# Altium schematic sheet pwr.SchDoc
size A4
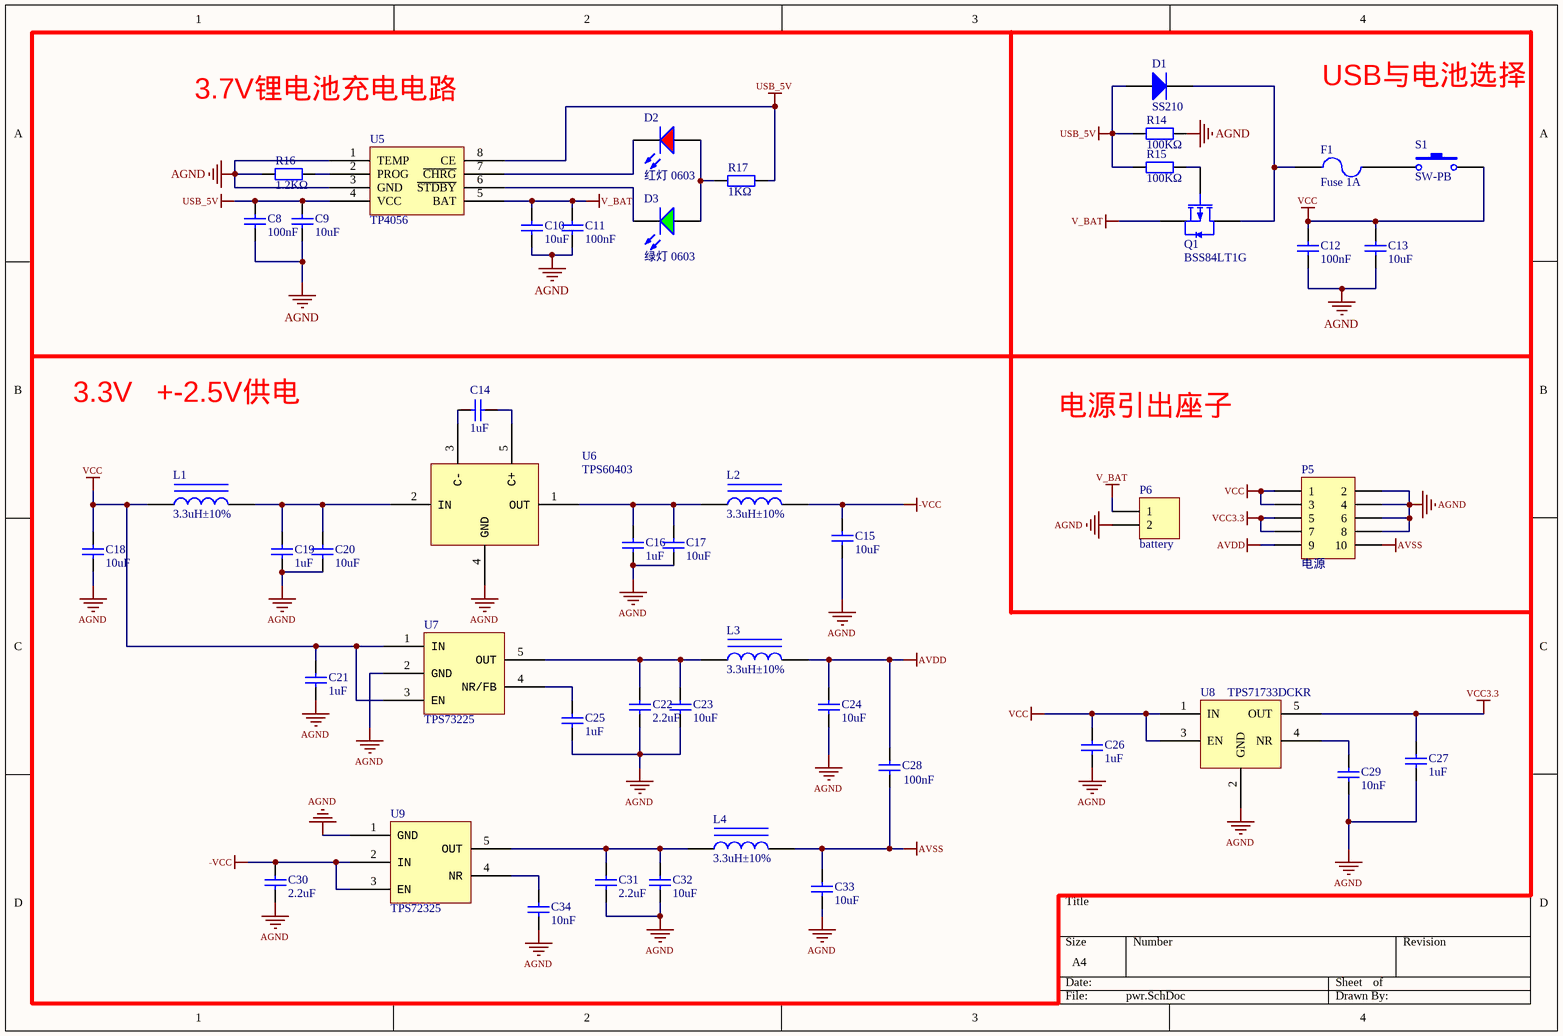
[diagram p0: pwr.SchDoc]

## Parts
C8  100nF  [0402_C]
C9  10uF  [0402_C]
C10  10uF  [0402_C]
C11  100nF  [0402_C]
C12  100nF  [0402_C]
C13  10uF  [0402_C]
C14  1uF  [0402_C]
C15  10uF  [0402_C]
C16  1uF  [0402_C]
C17  10uF  [0402_C]
C18  10uF  [0402_C]
C19  1uF  [0402_C]
C20  10uF  [0402_C]
C21  1uF  [0402_C]
C22  2.2uF  [0603_C]
C23  10uF  [0402_C]
C24  10uF  [0402_C]
C25  1uF  [0402_C]
C26  1uF  [0402_C]
C27  1uF  [0402_C]
C28  100nF  [0402_C]
C29  10nF  [0402_C]
C30  2.2uF  [0603_C]
C31  2.2uF  [0603_C]
C32  10uF  [0402_C]
C33  10uF  [0402_C]
C34  10nF  [0402_C]
D1  SS210  [SMA(DO-214AC)_S1]
D2  红灯 0603  [0603_LED_S1]
D3  绿灯 0603  [0603_LED_S1]
F1  Fuse 1A  [0805_R]
L1  3.3uH±10%  [0805_L]
L2  3.3uH±10%  [0805_L]
L3  3.3uH±10%  [0805_L]
L4  3.3uH±10%  [0805_L]
P5  电源  [HDR2X5]
P6  battery  [HDR1X2]
Q1  BSS84LT1G  [SOT-23(SOT-23-3)]
R14  100KΩ  [0402_R]
R15  100KΩ  [0402_R]
R16  1.2KΩ  [0402_R]
R17  1KΩ  [0402_R]
S1  SW-PB  [KEY_5.8*5.8]
U5  TP4056  [SOP-8_EP_150mil]
U6  TPS60403  [SOT-23-5]
U7  TPS73225  [SOT-23-5]
U8  TPS71733DCKR  [SC-70-5]
U9  TPS72325  [SOT-23-5]

## Nets
-VCC: C15.2 C30.2 L2.2 U9.2(IN) U9.3(EN)
AGND: C8.1 C9.1 C10.1 C11.1 C12.1 C13.1 C15.1 C16.1 C17.1 C18.1 C19.1 C20.1 C21.1 C22.1 C23.1 C24.1 C25.1 C26.1 C27.1 C29.1 C30.1 C31.1 C32.1 C33.1 C34.1 P5.2 P5.4 P5.6 P5.8 P6.2 R14.2 R16.1 U5.1(TEMP) U5.3(GND) U6.4(GND) U7.2(GND) U8.2(GND) U9.1(GND)
AVDD: C24.2 C28.2 L3.2 P5.9
AVSS: C28.1 C33.2 L4.2 P5.10
USB_5V: C8.2 C9.2 D1.1(A) R14.1 R15.1 R17.2 U5.4(VCC) U5.8(CE)
V_BAT: C10.2 C11.2 P6.1 Q1.2(S) U5.5(BAT)
VCC: C12.2 C13.2 C18.2 C21.2 C26.2 L1.1 P5.1 P5.3 S1.2 U7.1(IN) U7.3(EN) U8.1(IN) U8.3(EN)
VCC3.3: C27.2 P5.5 P5.7 U8.5(OUT)
NetC14_1: C14.1 U6.5(C+)
NetC14_2: C14.2 U6.3(C-)
NetC16_2: C16.2 C17.2 L2.1 U6.1(OUT)
NetC19_2: C19.2 C20.2 L1.2 U6.2(IN)
NetC22_2: C22.2 C23.2 L3.1 U7.5(OUT)
NetC25_2: C25.2 U7.4(NR/FB)
NetC29_2: C29.2 U8.4(NR)
NetC31_2: C31.2 C32.2 L4.1 U9.5(OUT)
NetC34_2: C34.2 U9.4(NR)
NetD1_2: D1.2(K) F1.1 Q1.3(D)
NetD2_A: D2.A D3.A R17.1
NetD2_K: D2.K U5.7(~{CHRG})
NetD3_K: D3.K U5.6(~{STDBY})
NetF1_2: F1.2 S1.1
NetQ1_1: Q1.1(G) R15.2
NetR16_2: R16.2 U5.2(PROG)

## Notes on the sheet
- 3.7V锂电池充电电路
- USB与电池选择
- 3.3V   +-2.5V供电
- 电源引出座子

## Library data of the parts
C8 C11 C12 C28 = 0402 100nF (104) 10% 16V: 贴片电容; ComponentLink1Description: 供应商链接; ComponentLink1URL: http://www.szlcsc.com/product/details_1877.html; Package: 0402; Supplier: LC; SuppliersPartNumber: C1525
C9 C10 C13 C15 C17 C18 C20 C23 C24 C32 C33 = 0402 10uF (106) 20% 6.3V: 贴片电容; ComponentLink1Description: 供应商链接; ComponentLink1URL: http://www.szlcsc.com/product/details_16204.html; Package: 0402; Supplier: LC; SuppliersPartNumber: C15525
C14 C16 C19 C21 C25-C27 = 0603 1uF (105) 10% 50V: 贴片电容; ComponentLink1Description: 供应商链接; ComponentLink1URL: http://www.szlcsc.com/product/details_16531.html; Package: 0603; Supplier: LC; SuppliersPartNumber: C15849
C22 C30 C31 = 0603 2.2uF (225) 10% 16V: 贴片电容; ComponentLink1Description: 供应商链接; ComponentLink1URL: http://www.szlcsc.com/product/details_24366.html; Package: 0603; Supplier: LC; SuppliersPartNumber: C23630
C29 C34 = 0402 10nF (103) 10% 50V: 贴片电容; ComponentLink1Description: 供应商链接; ComponentLink1URL: http://www.szlcsc.com/product/details_15869.html; Package: 0402; Supplier: LC; SuppliersPartNumber: C15195
D1 = SMA(DO-214AC) SS210: 二极管; ComponentLink1Description: 供应商链接; ComponentLink1URL: http://www.szlcsc.com/product/details_15669.html; Package: SMA(DO-214AC); Supplier: LC; SuppliersPartNumber: C14996
D2 = 0603 红灯: 发光二极管; ComponentLink1Description: 供应商链接; ComponentLink1URL: http://www.szlcsc.com/product/details_2659.html; Package: 0603; Supplier: LC; SuppliersPartNumber: C2286
D3 = 0603 绿灯: 发光二极管; ComponentLink1Description: 供应商链接; ComponentLink1URL: http://www.szlcsc.com/product/details_73152.html; Package: 0603; Supplier: LC; SuppliersPartNumber: C72043
F1 = Fuse 2: Fuse; Published: 8-Jun-2000; LatestRevisionDate: 17-Jul-2002; LatestRevisionNote: Re-released for DXP Platform.; PackageReference: PIN-W2/E2.8; Publisher: Altium Limited; PackageDescription: Thru-Hole; 2 Leads
L1-L4 = 0805 3.3uH10%: 贴片电感; ComponentLink1Description: 供应商链接; ComponentLink1URL: http://www.szlcsc.com/product/details_52738.html; Package: 0805; Supplier: LC; SuppliersPartNumber: C51725
P5 = Header 5X2: Header, 5-Pin, Dual row; LatestRevisionDate: 17-Jul-2002; LatestRevisionNote: Re-released for DXP Platform.; Publisher: Altium Limited
P6 = Header 2: Header, 2-Pin; LatestRevisionDate: 17-Jul-2002; LatestRevisionNote: Re-released for DXP Platform.; Publisher: Altium Limited
Q1 = BSS84LT1G: MOS(场效应管); ComponentLink1Description: 供应商链接; ComponentLink1URL: http://www.szlcsc.com/product/details_8986.html; Package: SOT-23(SOT-23-3); Supplier: LC; SuppliersPartNumber: C8492
R14 R15 = 0402 100KΩ (1003) 1%: 贴片电阻; ComponentLink1Description: 供应商链接; ComponentLink1URL: http://www.szlcsc.com/product/details_26484.html; Package: 0402; Supplier: LC; SuppliersPartNumber: C25741
R16 = 0402 1.2KΩ (1201) 1%: 贴片电阻; ComponentLink1Description: 供应商链接; ComponentLink1URL: http://www.szlcsc.com/product/details_26605.html; Package: 0402; Supplier: LC; SuppliersPartNumber: C25862
R17 = 0402 1KΩ (1001) 1%: 贴片电阻; ComponentLink1Description: 供应商链接; ComponentLink1URL: http://www.szlcsc.com/product/details_12256.html; Package: 0402; Supplier: LC; SuppliersPartNumber: C11702
S1 = SW-PB: Switch; Published: 24-Mar-1999; LatestRevisionDate: 17-Jul-2002; LatestRevisionNote: Re-released for DXP Platform.; PackageReference: SPST-2; Publisher: Altium Limited; PackageDescription: Switch; 2 Leads
U5 = TP4056_[C16581]: 电池电源管理; ComponentLink1Description: 供应商链接; ComponentLink1URL: http://www.szlcsc.com/product/details_17264.html; Package: SOP-8_EP_150mil; Supplier: LC; SuppliersPartNumber: C16581